# EAGLE design Arduino Micro DRAM Tester 3B (EAGLE 9.5.0)
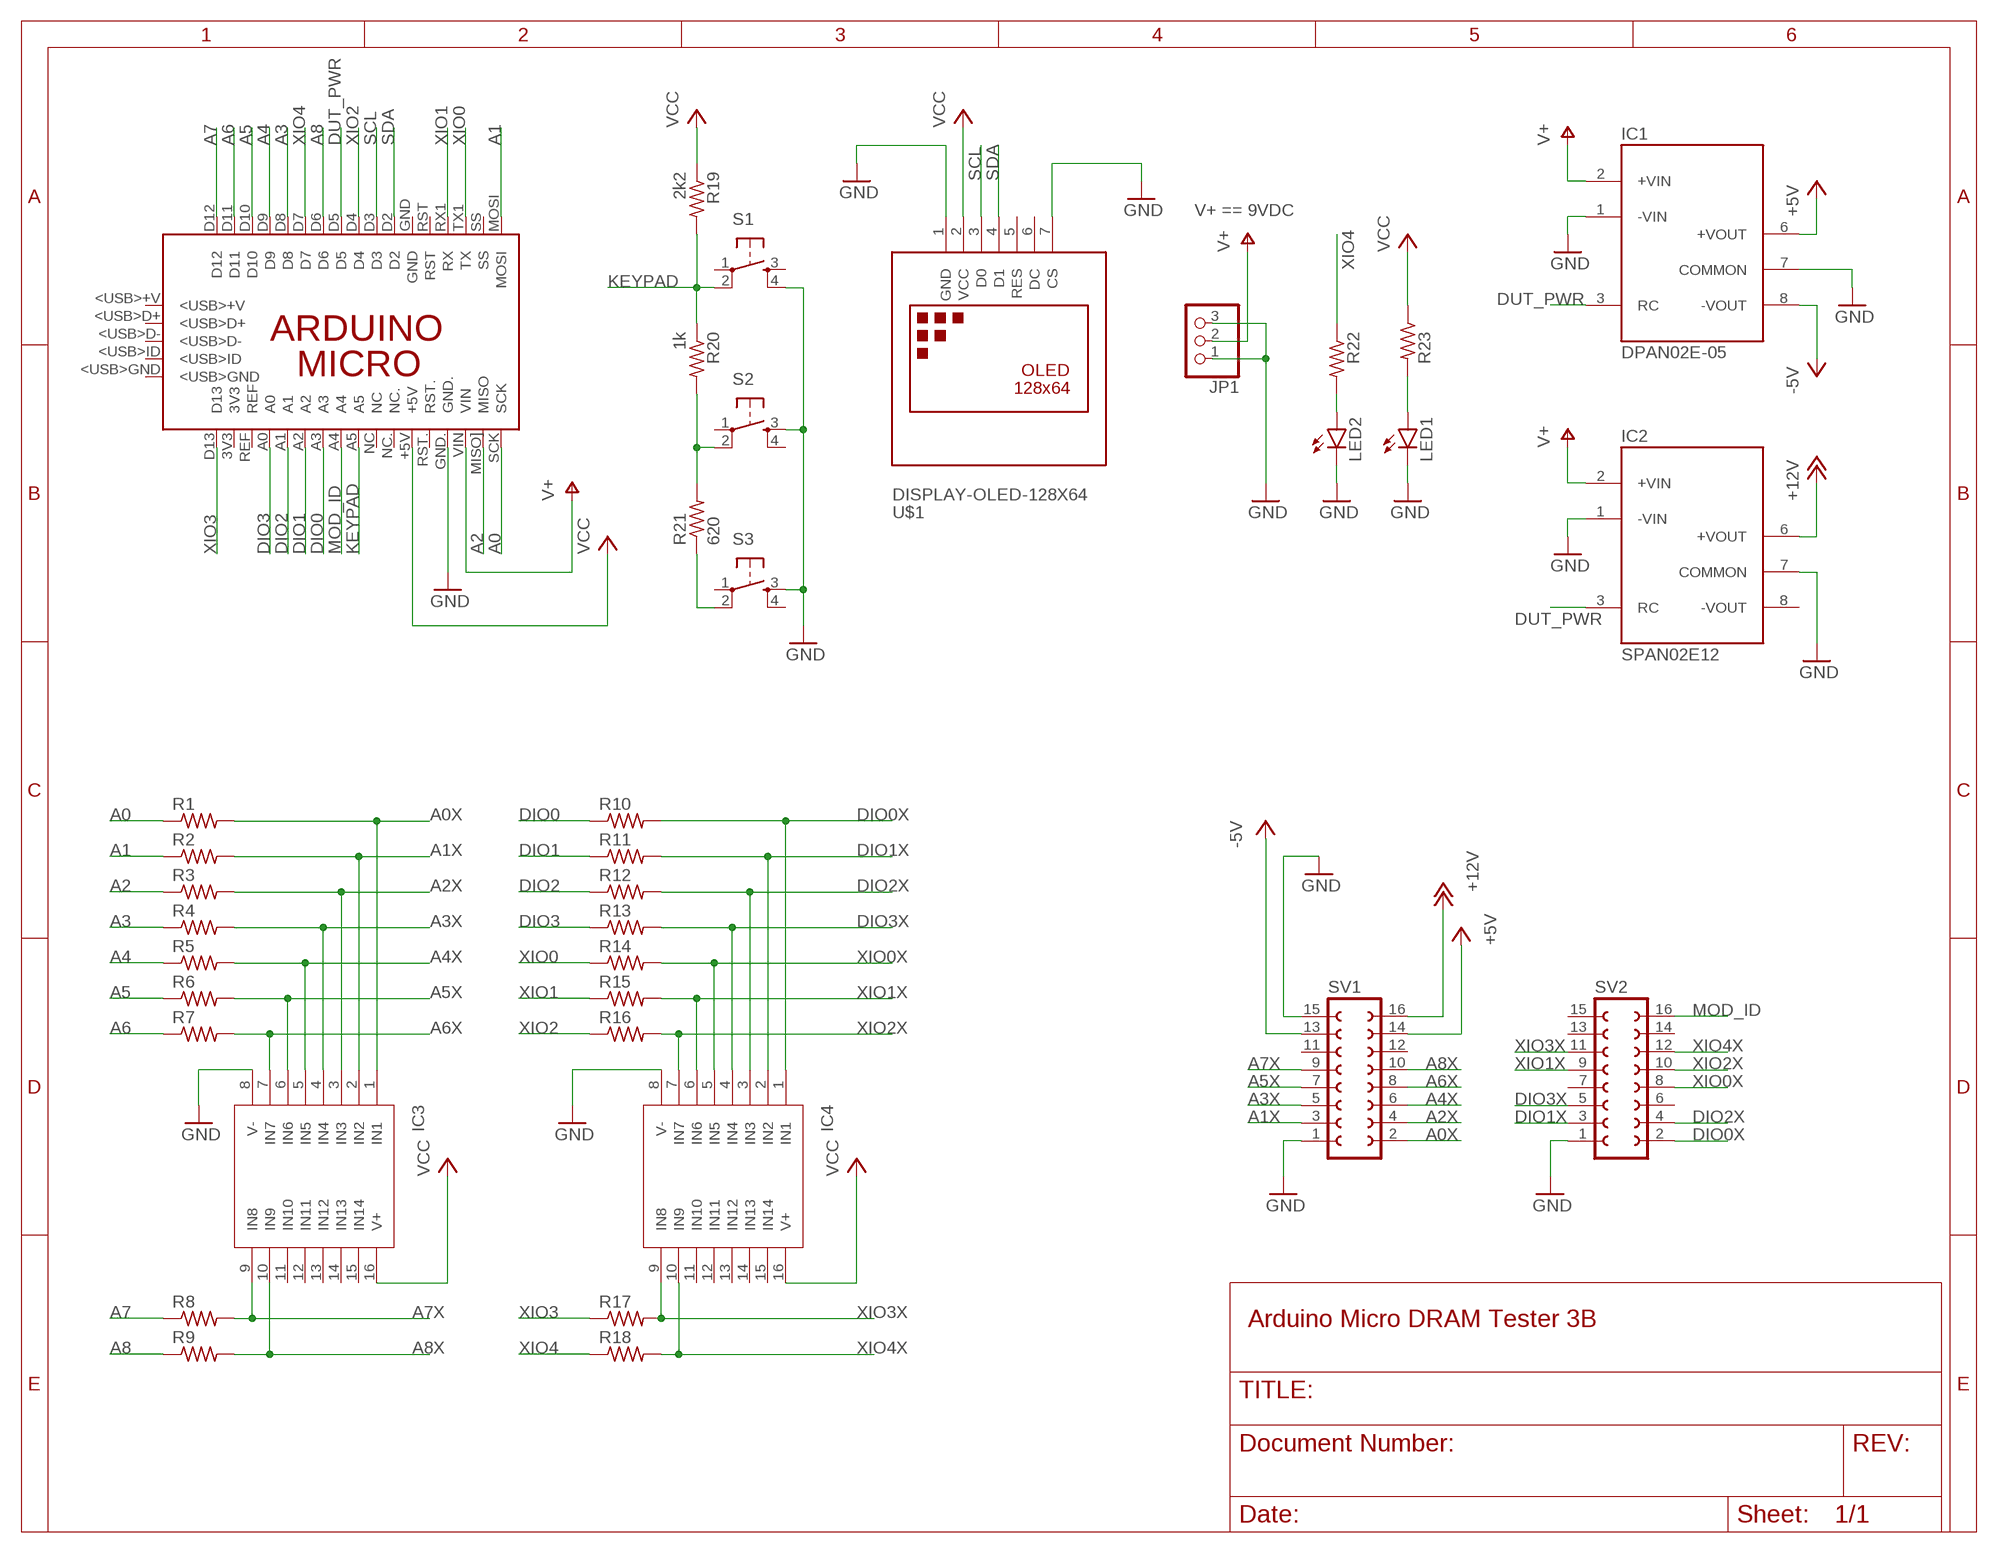
[diagram p0: schematic, sheet 1]

## Parts
IC1  DPAN02E-05  DPAN02  [SIP7]
IC2  SPAN02E12  DPAN02  [SIP7]
IC3  SP720  [DIL16]
IC4  SP720  [DIL16]
JP1  PINHD-1X3/90  [1X03/90]
LED1  LED5MM  [LED5MM]
LED2  LED5MM  [LED5MM]
PCB1  ARDUINO_MICRO  [ARDUINO_MICRO]
R1  R-US_0204/7  [0204/7]
R2  R-US_0204/7  [0204/7]
R3  R-US_0204/7  [0204/7]
R4  R-US_0204/7  [0204/7]
R5  R-US_0204/7  [0204/7]
R6  R-US_0204/7  [0204/7]
R7  R-US_0204/7  [0204/7]
R8  R-US_0204/7  [0204/7]
R9  R-US_0204/7  [0204/7]
R10  R-US_0204/7  [0204/7]
R11  R-US_0204/7  [0204/7]
R12  R-US_0204/7  [0204/7]
R13  R-US_0204/7  [0204/7]
R14  R-US_0204/7  [0204/7]
R15  R-US_0204/7  [0204/7]
R16  R-US_0204/7  [0204/7]
R17  R-US_0204/7  [0204/7]
R18  R-US_0204/7  [0204/7]
R19  2k2  R-US_0204/7  [0204/7]
R20  1k  R-US_0204/7  [0204/7]
R21  620  R-US_0204/7  [0204/7]
R22  R-US_0204/7  [0204/7]
R23  R-US_0204/7  [0204/7]
S1  TAC_SWITCHPTH  [TACTILE-PTH]
S2  TAC_SWITCHPTH  [TACTILE-PTH]
S3  TAC_SWITCHPTH  [TACTILE-PTH]
SV1  FE08-2  [FE08-2]
SV2  FE08-2  [FE08-2]
U$1  DISPLAY-OLED-128X64  [DISPLAY-OLED-128X64]

## Nets
+5V: IC1.6(+VOUT) SV1.14
+12V: IC2.6(+VOUT) SV1.16
-5V: IC1.8(-VOUT) SV1.13
A0: PCB1.SCK R1.1
A0X: IC3.1(IN1) R1.2 SV1.2
A1: PCB1.MOSI R2.1
A1X: IC3.2(IN2) R2.2 SV1.3
A2: PCB1.MISO](MISO) R3.1
A2X: IC3.3(IN3) R3.2 SV1.4
A3: PCB1.D8 R4.1
A3X: IC3.4(IN4) R4.2 SV1.5
A4: PCB1.D9 R5.1
A4X: IC3.5(IN5) R5.2 SV1.6
A5: PCB1.D10 R6.1
A5X: IC3.6(IN6) R6.2 SV1.7
A6: PCB1.D11 R7.1
A6X: IC3.7(IN7) R7.2 SV1.8
A7: PCB1.D12 R8.1
A7X: IC3.9(IN8) R8.2 SV1.9
A8: PCB1.D6 R9.1
A8X: IC3.10(IN9) R9.2 SV1.10
DIO0: PCB1.A3 R10.1
DIO0X: IC4.1(IN1) R10.2 SV2.2
DIO1: PCB1.A2 R11.1
DIO1X: IC4.2(IN2) R11.2 SV2.3
DIO2: PCB1.A1 R12.1
DIO2X: IC4.3(IN3) R12.2 SV2.4
DIO3: PCB1.A0 R13.1
DIO3X: IC4.4(IN4) R13.2 SV2.5
DUT_PWR: IC1.3(RC) IC2.3(RC) PCB1.D5
GND: IC1.1(-VIN) IC1.7(COMMON) IC2.1(-VIN) IC2.7(COMMON) IC3.8(V-) IC4.8(V-) JP1.1 JP1.3 LED1.K(C) LED2.K(C) PCB1.GND. S1.4 S2.3 S3.3 SV1.1 SV1.15 SV2.1 U$1.1(GND) U$1.7(CS)
KEYPAD: PCB1.A5 R19.2 R20.1 S1.2
MOD_ID: PCB1.A4 SV2.16
N$2: R20.2 R21.2 S2.2
N$3: R21.1 S3.2
N$6: LED1.A R23.2
N$20: LED2.A R22.2
SCL: PCB1.D3 U$1.3(D0)
SDA: PCB1.D2 U$1.4(D1)
V+: IC1.2(+VIN) IC2.2(+VIN) JP1.2 PCB1.VIN
VCC: IC3.16(V+) IC4.16(V+) PCB1.+5V R19.1 R23.1 U$1.2(VCC)
XIO0: PCB1.TX1(TX) R14.1
XIO0X: IC4.5(IN5) R14.2 SV2.8
XIO1: PCB1.RX1(RX) R15.1
XIO1X: IC4.6(IN6) R15.2 SV2.9
XIO2: PCB1.D4 R16.1
XIO2X: IC4.7(IN7) R16.2 SV2.10
XIO3: PCB1.D13 R17.1
XIO3X: IC4.9(IN8) R17.2 SV2.11
XIO4: PCB1.D7 R18.1 R22.1
XIO4X: IC4.10(IN9) R18.2 SV2.12
Unconnected: IC2.8(-VOUT) IC3.11(IN10) IC3.12(IN11) IC3.13(IN12) IC3.14(IN13) IC3.15(IN14) IC4.11(IN10) IC4.12(IN11) IC4.13(IN12) IC4.14(IN13) IC4.15(IN14) PCB1.3V3 PCB1.<USB>+V PCB1.<USB>D+ PCB1.<USB>D- PCB1.<USB>GND PCB1.<USB>ID PCB1.GND PCB1.NC PCB1.NC. PCB1.REF PCB1.RST PCB1.RST. PCB1.SS S1.1 S1.3 S2.1 S2.4 S3.1 S3.4 SV1.11 SV1.12 SV2.6 SV2.7 SV2.13 SV2.14 SV2.15 U$1.5(RES) U$1.6(DC)

## Notes on the sheet
- V+ == 9VDC

## Library data of the parts
IC1 IC2 = MW DPAN02:DPAN02
IC3 IC4 = Littlefuse:SP720
JP1 = pinhead:PINHD-1X3: PIN HEADER
LED1 LED2 = led:LED: LED OSRAM: - CHIPLED LG R971, LG N971, LY N971, LG Q971, LY Q971, LO R971, LY R971 LH N974, LH R974 LS Q976, LO Q976, LY Q976 LO Q996 - Hyper CHIPLED LW Q18S LB Q993, LB Q99A, LB R99A - SideLED LS A670, LO A670, LY A670, LG A670, LP A670 LB A673, LV A673, LT A673, LW A673 LH A674 LY A675 LS A676, LA A676, LO A676, LY A676, LW A676 LS A679, LY A679, LG A679 - Hyper Micro SIDELED® LS Y876, LA Y876, LO Y876, LY Y876 LT Y87S - SmartLED LW L88C, LW L88S LB L89C, LB L89S, LG L890 LS L89K, LO L89K, LY L89K LS L896, LA L896, LO L896, LY L896 - TOPLED LS T670, LO T670, LY T670, LG T670, LP T670 LSG T670, LSP T670, LSY T670, LOP T670, LYG T670 LG T671, LOG T671, LSG T671 LB T673, LV T673, LT T673, LW T673 LH T674 LS T676, LA T676, LO T676, LY T676, LB T676, LH T676, LSB T676, LW T676 LB T67C, LV T67C, LT T67C, LS T67K, LO T67K, LY T67K, LW E67C LS E67B, LA E67B, LO E67B, LY E67B, LB E67C, LV E67C, LT E67C LW T67C LS T679, LY T679, LG T679 LS T770, LO T770, LY T770, LG T770, LP T770 LB T773, LV T773, LT T773, LW T773 LH T774 LS E675, LA E675, LY E675, LS T675 LS T776, LA T776, LO T776, LY T776, LB T776 LHGB T686 LT T68C, LB T68C - Hyper Mini TOPLED® LB M676 - Mini TOPLED Santana® LG M470 LS M47K, LO M47K, LY M47K Source: http://www.osram.convergy.de LUXEON: - LUMILED® LXK2-PW12-R00, LXK2-PW12-S00, LXK2-PW14-U00, LXK2-PW14-V00 LXK2-PM12-R00, LXK2-PM12-S00, LXK2-PM14-U00 LXK2-PE12-Q00, LXK2-PE12-R00, LXK2-PE12-S00, LXK2-PE14-T00, LXK2-PE14-U00 LXK2-PB12-K00, LXK2-PB12-L00, LXK2-PB12-M00, LXK2-PB14-N00, LXK2-PB14-P00, LXK2-PB14-Q00 LXK2-PR12-L00, LXK2-PR12-M00, LXK2-PR14-Q00, LXK2-PR14-R00 LXK2-PD12-Q00, LXK2-PD12-R00, LXK2-PD12-S00 LXK2-PH12-R00, LXK2-PH12-S00 LXK2-PL12-P00, LXK2-PL12-Q00, LXK2-PL12-R00 Source: www.luxeon.com KINGBRIGHT: KA-3528ASYC Source: www.kingbright.com
PCB1 = E14_Arduino_revC:ARDUINO_MICRO: Device for representing an Arduino Micro board with a footprint in an EAGLE design. Created by Dave Young for Element14. More EAGLE documentation at: http://www.element14.com/community/community/knode/cadsoft_eagle
R1-R23 = resistor:R-US_: RESISTOR, American symbol
S1-S3 = SparkFun-Electromechanical:TAC_SWITCH: Momentary Switch Button commonly used for reset or general input. Spark Fun Electronics SKU : COM-00097 SMT- SWCH-08247
SV1 SV2 = con-lsta:FE08-2: FEMALE HEADER; OC_FARNELL: unknown; OC_NEWARK: unknown
U$1 = diy-modules:DISPLAY-OLED-128X64: 128x64 Dot Matrix OLED Module based on SSD1306 chip Variant with SPI interface More details available here: http://www.instructables.com/id/How-to-use-OLED-display-arduino-module/ SSD1306 datasheet: https://cdn-shop.adafruit.com/datasheets/SSD1306.pdf Click here to find device on ebay.com <http://www.ebay.com/sch/oled+display+128x64> Note: There are two variants: I2C and SPI. Search for the proper version.

## Board
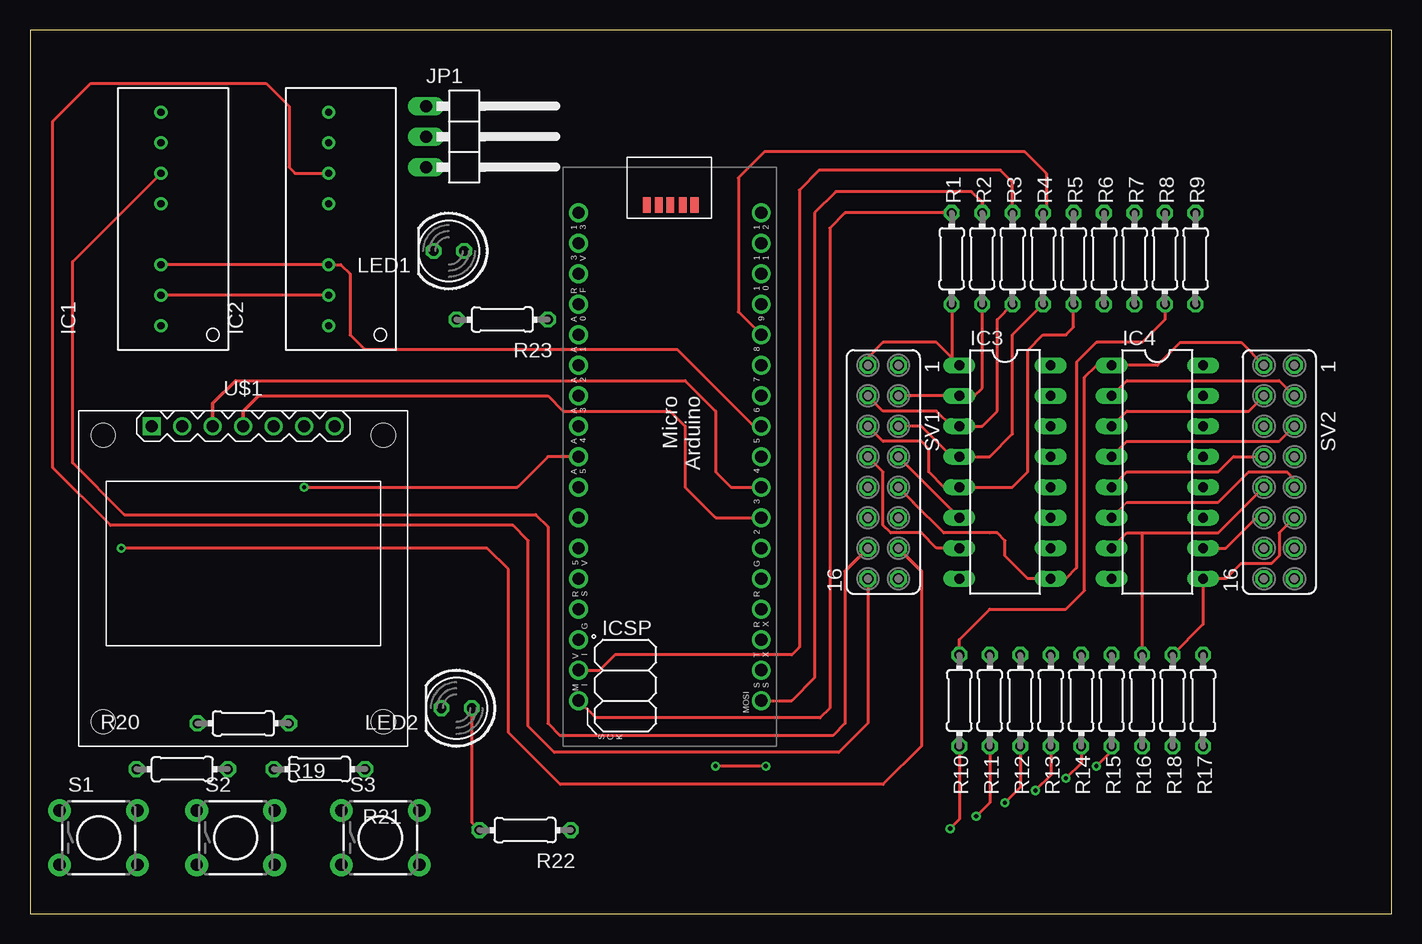
[diagram p1: board, top side]
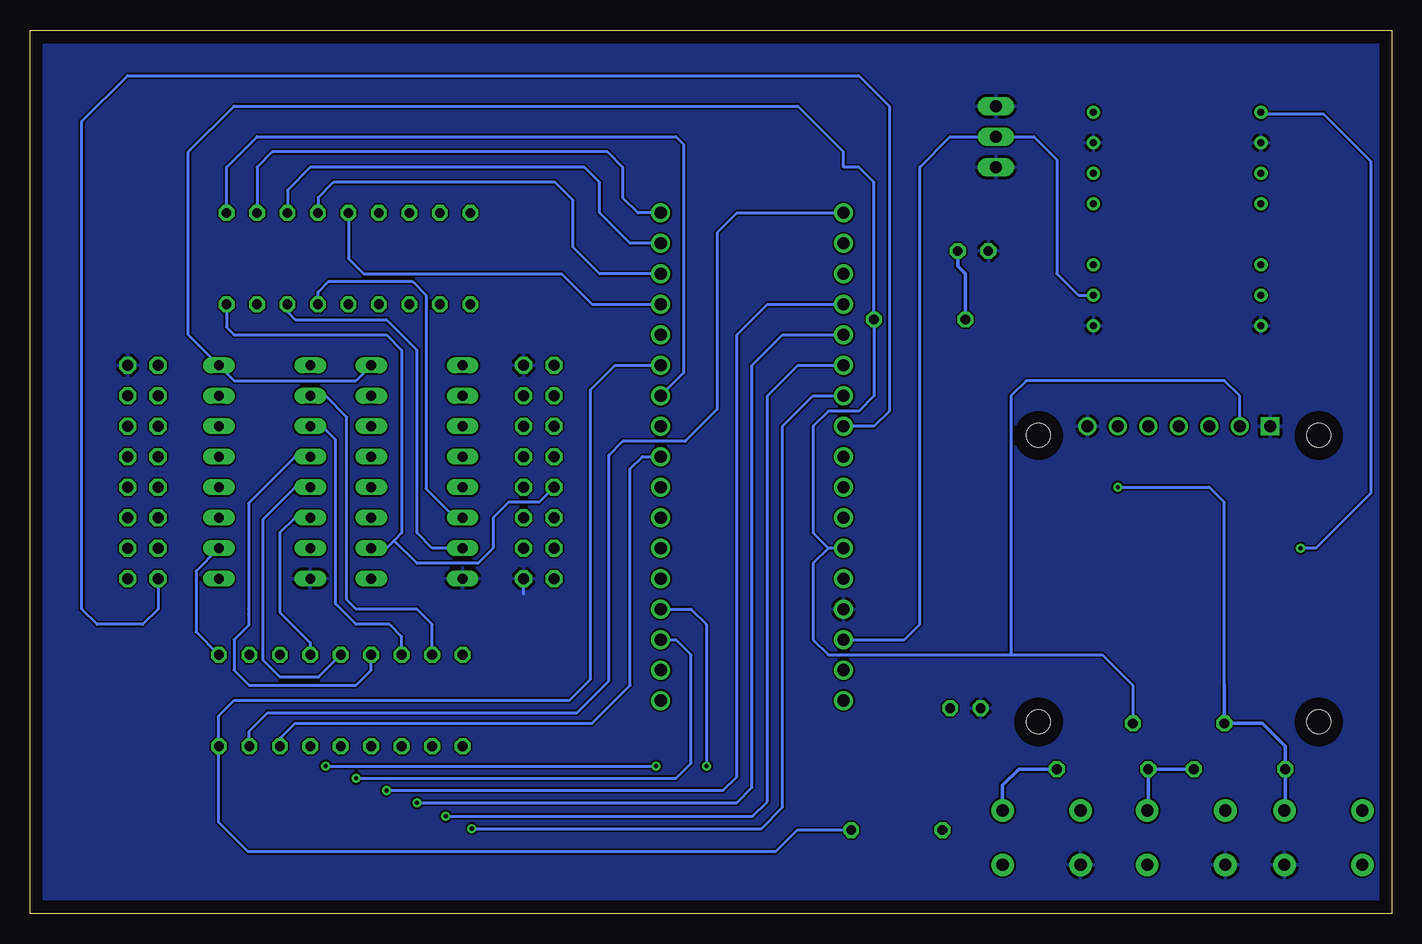
[diagram p2: board, bottom side, seen from below]

Size 113.54 x 73.66 mm. Coordinates in mm from the lower left corner, seen from the top.
Outline: 0,0 113.54,0 113.54,73.66 0,73.66 0,0
Copper layers (1*16): Top 0.035mm / dielectric 1.5mm / Bottom 0.035mm
Design rules "default": minimum track width 6mil, minimum drill 0.35mm, track to track 6mil, track to pad 6mil, pad to pad 6mil, via to via 6mil, smd to smd 6mil, copper to edge 40mil, drill to drill 6mil, minimum pad ring 10mil, minimum via ring 8mil, stop-mask expansion 4mil, vias tented up to drill 0mil, thermal gap 10mil

### Footprints (pad centres in the part's own frame; a part is rotated, then mirrored left to right if it is on the bottom)
SIP7 = drill 0.6: 1 2.032,5.588; 2 4.572,5.588; 3 7.112,5.588; 5 12.192,5.588; 6 14.732,5.588; 7 17.272,5.588; 8 19.812,5.588
DIL16 = drill 0.813 long: 1 -8.89,-3.81; 2 -6.35,-3.81; 3 -3.81,-3.81; 4 -1.27,-3.81; 5 1.27,-3.81; 6 3.81,-3.81; 7 6.35,-3.81; 8 8.89,-3.81; 9 8.89,3.81; 10 6.35,3.81; 11 3.81,3.81; 12 1.27,3.81; 13 -1.27,3.81; 14 -3.81,3.81; 15 -6.35,3.81; 16 -8.89,3.81
1X03/90 = drill 1.016 long: 1 -2.54,-3.81; 2 0,-3.81; 3 2.54,-3.81
LED5MM = drill 0.813 octagon: A -1.27,0; K 1.27,0
ARDUINO_MICRO = drill 1.016 pad 1.575: 3V3 6.35,1.27; +5V 31.75,1.27; A0 11.43,1.27; A1 13.97,1.27; A2 16.51,1.27; A3 19.05,1.27; A4 21.59,1.27; A5 24.13,1.27; D2 29.21,16.51; D3 26.67,16.51; D4 24.13,16.51; D5 21.59,16.51; D6 19.05,16.51; D7 16.51,16.51; D8 13.97,16.51; D9 11.43,16.51; D10 8.89,16.51; D11 6.35,16.51; D12 3.81,16.51; D13 3.81,1.27; GND 31.75,16.51; GND. 36.83,1.27; MISO] 41.91,1.27; MOSI 44.45,16.51; NC 26.67,1.27; NC. 29.21,1.27; REF 8.89,1.27; RST 34.29,16.51; RST. 34.29,1.27; RX1 36.83,16.51; SCK 44.45,1.27; SS 41.91,16.51; TX1 39.37,16.51; VIN 39.37,1.27 | smd 1.27 x 0.635: <USB>+V 3.15,10.947; <USB>D+ 3.15,9.957; <USB>D- 3.15,8.941; <USB>GND 3.15,6.96; <USB>ID 3.15,7.976
0204/7 = drill 0.813 octagon: 1 -3.81,0; 2 3.81,0
TACTILE-PTH = drill 1.016 pad 1.88: 1 -3.251,2.261; 2 3.251,2.261; 3 -3.251,-2.261; 4 3.251,-2.261
FE08-2 = drill 0.914 octagon: 1 -8.89,1.27; 2 -8.89,-1.27; 3 -6.35,1.27; 4 -6.35,-1.27; 5 -3.81,1.27; 6 -3.81,-1.27; 7 -1.27,1.27; 8 -1.27,-1.27; 9 1.27,1.27; 10 1.27,-1.27; 11 3.81,1.27; 12 3.81,-1.27; 13 6.35,1.27; 14 6.35,-1.27; 15 8.89,1.27; 16 8.89,-1.27
DISPLAY-OLED-128X64 = drill 1 square: 1 -7.62,12.7 | drill 1: 2 -5.08,12.7; 3 -2.54,12.7; 4 0,12.7; 5 2.54,12.7; 6 5.08,12.7; 7 7.62,12.7 | hole 2: -11.684,11.938; 11.684,11.938; 11.684,-11.938; -11.684,-11.938

### Placement (x,y rotation side)
IC1  16.51,46.99 90 top
IC2  30.48,46.99 90 top
IC3  81.28,36.83 270 top
IC4  93.98,36.83 270 top
JP1  36.83,64.77 270 top
LED1  34.92,55.24 180 top
LED2  35.56,17.14 180 top
PCB1  44.45,62.23 270 top
R1  76.83,54.61 270 top
R2  79.38,54.61 270 top
R3  81.92,54.61 270 top
R4  84.45,54.61 270 top
R5  87,54.61 270 top
R6  89.53,54.61 270 top
R7  92.08,54.61 270 top
R8  94.61,54.61 270 top
R9  97.16,54.61 270 top
R10  77.47,17.78 90 top
R11  80.01,17.78 90 top
R12  82.55,17.78 90 top
R13  85.09,17.78 90 top
R14  87.63,17.78 90 top
R15  90.17,17.78 90 top
R16  92.71,17.78 90 top
R17  95.25,17.78 90 top
R18  97.79,17.78 90 top
R19  17.78,15.88 180 top
R20  12.7,12.06 0 top
R21  24.13,12.06 180 top
R22  41.27,6.99 180 top
R23  39.37,49.53 180 top
S1  5.71,6.35 0 top
S2  17.14,6.35 0 top
S3  29.21,6.35 0 top
SV1  71.12,36.83 270 top
SV2  104.14,36.83 270 top
U$1  17.78,27.94 0 top

### Tracks (layer width: path | path; a pad name or v marks a point on that pad's centre or on a via)
+5V
  Top 0.254: 67.94,28.57 67.94,15.88 66.93,14.86 44.2,14.86 43.18,15.88 43.18,32.26 42.16,33.27 7.87,33.27 3.56,37.59 3.56,54.36 IC1.6
  Top 0.305: SV1.14 67.94,28.57
+12V
  Top 0.254: SV1.16 69.85,15.88 67.44,13.46 43.69,13.46 41.53,15.62 41.53,31.11 40.26,32.38 6.71,32.38 1.91,37.19 1.91,66.04 5.08,69.22 19.68,69.22 21.59,67.31 21.59,62.23 22.1,61.72 IC2.6
-5V  (via drill 0.35)
  Top 0.254: 74.3,28.57 74.3,13.97 71.12,10.79 44.2,10.79 39.88,15.11 39.88,28.7 38.1,30.48 v7.62,30.48
  Top 0.305: SV1.13 74.3,28.57
  Bottom 0.254: v7.62,30.48 6.35,30.48 1.78,35.05 1.78,62.74 5.71,66.67 10.79,66.67 IC1.8
A0
  Top 0.254: R1.1 67.94,58.42 66.67,57.15 66.67,17.14 65.86,16.33 47.17,16.33 PCB1.SCK
A0X
  Top 0.152: 69.85,46.35 SV1.2 | 76.83,46.35 IC3.1
  Top 0.254: 69.85,46.35 71.12,47.62 75.56,47.62 IC3.1 | R1.2 76.83,46.35
A1
  Top 0.254: 79.38,59.31 78.49,60.2 67.18,60.2 65.41,58.42 65.41,43.18 65.41,19.68 63.5,17.78 PCB1.MOSI
  Top 0.305: R2.1 79.38,59.31
A1X
  Top 0.152: IC3.2 78.74,43.18
  Top 0.254: IC3.2 SV1.3 | 78.74,43.18 79.38,43.81 R2.2
A2
  Top 0.254: R3.1 81.92,60.96 80.9,61.98 65.79,61.98 64.14,60.33 64.14,22.23 63.5,21.59 48.77,21.59 47.5,20.32 PCB1.MISO]
A2X
  Top 0.152: IC3.3 76.83,40.64
  Top 0.254: 76.83,40.64 75.56,41.91 71.12,41.91 SV1.4 | IC3.3 79.38,40.64 80.64,41.91 80.64,49.53 R3.2
A3
  Top 0.254: 84.71,58.67 84.71,61.72 82.93,63.5 61.21,63.5 59.05,61.34 59.05,50.16 PCB1.D8
  Top 0.305: R4.1 84.71,58.67
A3X
  Top 0.152: IC3.4 76.83,38.1
  Top 0.254: 76.83,38.1 74.3,40.64 SV1.5 | IC3.4 80.01,38.1 81.92,40.01 81.92,48.26 R4.2
A4
  Bottom 0.254: PCB1.D9 66.67,50.8 69.22,53.34 85.72,53.34 87,54.61 R5.1
A4X
  Top 0.254: SV1.6 71.12,39.37 74.3,39.37 74.93,38.73 74.93,36.83 76.2,35.56 IC3.5 81.92,35.56 83.19,36.83 83.19,46.99 84.45,48.26 86.36,48.26 87,48.9 R5.2
A5
  Bottom 0.254: PCB1.D10 66.04,53.34 68.25,55.55 68.25,59.45 69.75,60.96 88.27,60.96 89.53,59.69 R6.1
A5X
  Top 0.254: IC3.6 SV1.7
  Bottom 0.254: R6.2 89.53,51.82 88.65,52.7 81.66,52.7 80.52,51.56 80.52,35.43 78.11,33.02 IC3.6
A6
  Bottom 0.254: R7.1 92.08,60.33 90.17,62.23 67.31,62.23 66.04,60.96 66.04,58.42 63.5,55.88 PCB1.D11
A6X
  Top 0.254: IC3.7 75.56,30.48 74.3,31.75 71.75,31.75 71.12,32.38 71.12,36.83 SV1.8
  Bottom 0.254: R7.2 92.08,50.16 91.44,49.53 83.82,49.53 81.28,46.99 81.28,31.75 80.01,30.48 IC3.7
A7
  Bottom 0.254: PCB1.D12 62.87,58.42 64.14,59.69 64.14,62.23 65.41,63.5 93.34,63.5 94.61,62.23 R8.1
A7X
  Top 0.152: 86.36,27.94 IC3.9
  Top 0.254: IC3.9 83.19,27.94 81.28,29.84 81.28,31.11 80.64,31.75 80.01,31.75 76.19,31.75 73.66,34.28 73.66,34.29 SV1.9 | R8.2 94.61,49.53 92.71,47.62 88.9,47.62 87.25,45.97 87.25,28.83 86.36,27.94
A8
  Bottom 0.254: R9.1 97.16,62.23 94.61,64.77 59.69,64.77 59.05,64.14 59.05,45.09 PCB1.D6
A8X
  Bottom 0.254: SV1.10 71.12,34.29 73.66,34.29 74.93,33.02 74.93,30.48 76.2,29.21 81.28,29.21 83.19,31.11 | R9.2 97.16,48.9 96.52,48.26 83.82,48.26 82.55,46.99 82.55,31.75 83.19,31.11 | 83.19,31.11 83.82,30.48 IC3.10
DIO0  (via drill 0.35)
  Top 0.254: R10.1 77.47,7.87 v76.71,7.11
  Bottom 0.254: v76.71,7.11 52.58,7.11 50.8,8.89 50.8,40.64 48.26,43.18 PCB1.A3
DIO0X
  Top 0.254: SV2.2 100.97,47.62 95.89,47.62 93.98,45.72 IC4.1 88.92,45.72 87.91,44.7 87.91,26.95 86.36,25.4 80.01,25.4 77.47,22.86 R10.2
DIO1  (via drill 0.35)
  Top 0.254: R11.1 80.01,9.27 v78.88,8.14
  Bottom 0.254: v78.88,8.14 53.29,8.14 52.07,9.36 52.07,43.18 49.53,45.72 PCB1.A2
DIO1X
  Top 0.254: IC4.2 91.44,44.45 104.14,44.45 SV2.3
  Bottom 0.254: R11.2 80.01,24.13 81.28,25.4 86.36,25.4 87.12,26.16 87.12,41.4 88.9,43.18 IC4.2
DIO2  (via drill 0.35)
  Top 0.254: R12.1 82.55,10.54 v81.28,9.27
  Bottom 0.254: v81.28,9.27 54.61,9.27 53.34,10.54 53.34,45.72 50.8,48.26 PCB1.A1
DIO2X
  Top 0.254: IC4.3 91.44,41.91 101.6,41.91 SV2.4
  Bottom 0.254: IC4.3 89.2,40.64 88.06,39.51 88.06,25.83 86.36,24.13 83.57,24.13 82.55,23.11 R12.2
DIO3  (via drill 0.35)
  Top 0.254: R13.1 85.09,11.56 v83.82,10.29
  Bottom 0.254: PCB1.A0 52.07,50.8 54.61,48.26 54.61,11.43 55.75,10.29 v83.82,10.29
DIO3X
  Top 0.254: IC4.4 91.44,39.37 104.14,39.37 SV2.5
  Bottom 0.254: R13.2 85.09,20.32 86.36,19.05 95.25,19.05 96.52,20.32 96.52,22.86 95.33,24.05 95.33,24.97 95.33,25.4 95.33,34.21 91.44,38.1 IC4.4
DUT_PWR
  Top 0.254: IC1.3 IC2.3 25.91,54.1 26.67,53.34 26.67,48.26 27.88,47.05 53.93,47.05 60.35,40.64
  Top 0.305: PCB1.D5 60.35,40.64
GND
  Bottom 0.254: 72.39,26.67 SV1.15 | 25.96,4.52 S3.3
  pour Bottom: 0.64,72.39 112.39,72.39 112.39,1.27 0.64,1.27
KEYPAD  (via drill 0.35)
  Top 0.254: v22.86,35.56 40.64,35.56 43.18,38.1 PCB1.A5
  Bottom 0.254: 13.97,19.05 13.97,34.29 15.24,35.56 v22.86,35.56
  Bottom 0.305: S1.2 8.89,8.69 R20.1 8.89,13.97 10.79,15.88 R19.2 13.97,19.05
MOD_ID
  Bottom 0.254: SV2.16 102.87,25.4 104.14,24.13 107.95,24.13 109.22,25.4 109.22,66.04 105.41,69.85 44.45,69.85 41.91,67.31 41.91,41.91 43.18,40.64 PCB1.A4
N$2
  Bottom 0.305: S2.2 20.32,8.69 R21.2 R20.2
N$3
  Bottom 0.305: R21.1 31.11,12.06 32.46,10.72 S3.2
N$6
  Bottom 0.305: LED1.A 36.2,53.98 35.56,53.34 R23.2
N$20
  Top 0.254: LED2.A 36.83,7.62 R22.2
SCL
  Top 0.254: 17.14,44.45 54.61,44.45 57.15,41.91 57.15,36.83 58.42,35.56 PCB1.D3
  Top 0.305: U$1.3 15.24,42.55 17.14,44.45
SDA
  Top 0.254: PCB1.D2 57.15,33.02 54.61,35.56 54.61,40.64 53.34,41.91 44.45,41.91 43.18,43.18 19.05,43.18
  Top 0.305: U$1.4 17.78,41.91 19.05,43.18
V+
  Top 0.254: IC2.2 IC1.2
  Bottom 0.254: IC2.2 26.16,51.56 27.94,53.34 27.94,62.87 29.84,64.77 JP1.2 36.83,64.77 39.37,62.23 39.37,24.13 40.64,22.86 PCB1.VIN
VCC
  Bottom 0.254: IC3.16 86.36,44.45 96.52,44.45 IC4.16 100.33,48.26 100.33,63.5 96.52,67.31 49.53,67.31 45.72,63.5 45.72,62.23 44.45,62.23 43.18,60.96 R23.1 43.18,43.18 44.45,41.91 46.99,41.91 48.26,40.64 48.26,31.75 46.99,30.48 | PCB1.+5V 46.99,30.48 | 46.99,30.48 48.26,29.21 48.26,22.86 46.99,21.59 31.75,21.59 | R19.1 21.59,19.05 24.13,21.59 31.75,21.59 | U$1.2 12.7,43.18 13.97,44.45 30.48,44.45 31.75,43.18 31.75,21.59
XIO0  (via drill 0.35)
  Top 0.254: R14.1 87.63,12.57 v86.36,11.3
  Bottom 0.254: PCB1.TX1 59.69,22.86 58.42,21.59 58.42,12.57 59.69,11.3 v86.36,11.3
XIO0X
  Top 0.254: IC4.5 91.44,36.83 99.06,36.83 100.33,38.1 SV2.8
  Bottom 0.254: R14.2 89.47,19.75 92.71,19.75 94.13,21.17 94.13,32.87 91.44,35.56 IC4.5
XIO1  (via drill 0.35)
  Top 0.254: R15.1 90.17,13.59 v88.9,12.32 | v61.34,12.32 v57.15,12.32
  Bottom 0.254: PCB1.RX1 58.42,25.4 57.15,24.13 v57.15,12.32 | v88.9,12.32 v61.34,12.32
XIO1X
  Top 0.152: 91.44,34.29 IC4.6 | 105.41,36.2 SV2.9
  Top 0.254: 91.44,34.29 99.06,34.29 101.6,36.83 104.78,36.83 105.41,36.2
  Bottom 0.254: R15.2 90.17,22.61 92.71,25.15 92.71,31.75 91.44,33.02 IC4.6
XIO2
  Bottom 0.254: R16.1 92.71,14.61 91.44,15.88 66.67,15.88 63.5,19.05 63.5,37.08 62.48,38.1 PCB1.D4
XIO2X
  Top 0.254: 92.71,31.75 91.44,31.75 IC4.7 | 92.71,31.75 99.06,31.75 SV2.10 | R16.2 92.71,31.75
XIO3
  Bottom 0.254: R17.1 95.25,15.24 93.73,16.76 67.94,16.76 65.28,19.43 65.28,38.23 64.14,39.37 58.93,39.37 56.26,42.04 56.26,56.77 54.61,58.42 PCB1.D13
XIO3X
  Top 0.254: SV2.11 104.14,31.75 104.14,29.84 103.5,29.21 100.97,29.21 99.69,27.94 IC4.9 97.79,24.13 R17.2
XIO4
  Bottom 0.254: PCB1.D7 64.77,45.72 66.8,43.69 66.8,19.56 68.57,17.79 96.51,17.79 97.79,16.51 R18.1 97.79,7.62 95.35,5.18 51.39,5.18 49.59,6.99 R22.1
XIO4X
  Top 0.152: SV2.12 102.23,33.02
  Top 0.254: IC4.10 99.69,30.48 102.23,33.02
  Bottom 0.254: R18.2 99.69,23.5 99.69,28.57 IC4.10